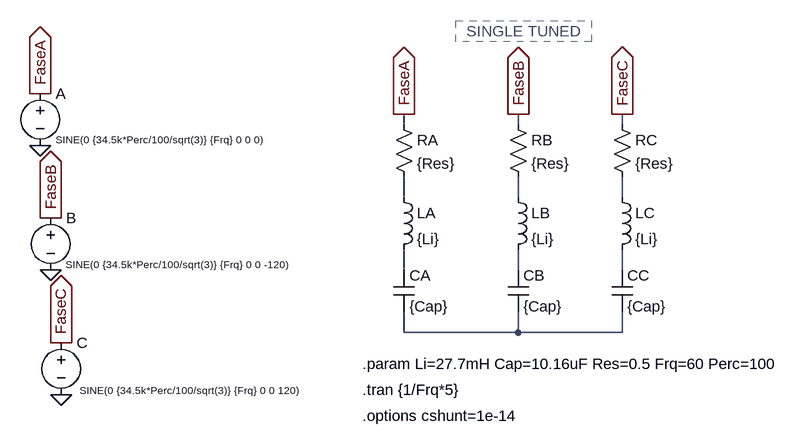
[diagram p0: schematic HarmonicFilterSigleTuned3Phase.asc]
HarmonicFilterSigleTuned3Phase.asc, the LTspice schematic file:
Version 4
SHEET 1 1632 680
WIRE 288 -16 288 -32
WIRE 464 -16 464 -32
WIRE 624 -16 624 -32
WIRE 288 96 288 64
WIRE 464 96 464 64
WIRE 624 96 624 64
WIRE 288 208 288 176
WIRE 464 208 464 176
WIRE 624 208 624 176
WIRE 288 304 288 272
WIRE 464 304 464 272
WIRE 464 304 288 304
WIRE 624 304 624 272
WIRE 624 304 464 304
FLAG -272 16 0
FLAG -256 208 0
FLAG -240 400 0
FLAG -272 -64 FaseA
IOPIN -272 -64 Out
FLAG 288 -32 FaseA
IOPIN 288 -32 Out
FLAG 464 -32 FaseB
IOPIN 464 -32 Out
FLAG 624 -32 FaseC
IOPIN 624 -32 Out
FLAG -256 128 FaseB
IOPIN -256 128 Out
FLAG -240 320 FaseC
IOPIN -240 320 Out
SYMBOL voltage -272 -80 R0
WINDOW 3 24 87 Left 1
WINDOW 123 31 86 Left 2
WINDOW 39 0 0 Left 0
SYMATTR Value SINE(0 {34.5k*Perc/100/sqrt(3)} {Frq} 0 0 0)
SYMATTR InstName A
SYMBOL res 272 -32 R0
SYMATTR InstName RA
SYMATTR Value {Res}
SYMBOL ind 272 80 R0
SYMATTR InstName LA
SYMATTR Value {Li}
SYMBOL cap 272 208 R0
SYMATTR InstName CA
SYMATTR Value {Cap}
SYMBOL res 448 -32 R0
SYMATTR InstName RB
SYMATTR Value {Res}
SYMBOL ind 448 80 R0
SYMATTR InstName LB
SYMATTR Value {Li}
SYMBOL cap 448 208 R0
SYMATTR InstName CB
SYMATTR Value {Cap}
SYMBOL res 608 -32 R0
SYMATTR InstName RC
SYMATTR Value {Res}
SYMBOL ind 608 80 R0
SYMATTR InstName LC
SYMATTR Value {Li}
SYMBOL cap 608 208 R0
SYMATTR InstName CC
SYMATTR Value {Cap}
SYMBOL voltage -256 112 R0
WINDOW 123 30 85 Left 2
WINDOW 39 0 0 Left 0
WINDOW 3 23 87 Left 1
SYMATTR Value SINE(0 {34.5k*Perc/100/sqrt(3)} {Frq} 0 0 -120)
SYMATTR InstName B
SYMBOL voltage -240 304 R0
WINDOW 123 31 85 Left 2
WINDOW 39 0 0 Left 0
WINDOW 3 29 89 Left 1
SYMATTR Value SINE(0 {34.5k*Perc/100/sqrt(3)} {Frq} 0 0 120)
SYMATTR InstName C
TEXT 224 352 Left 2 !.param Li=27.7mH Cap=10.16uF Res=0.5 Frq=60 Perc=100
TEXT 224 392 Left 2 !.tran {1/Frq*5}
TEXT 384 -160 Left 2 ;SINGLE TUNED
TEXT 224 432 Left 2 !.options cshunt=1e-14
RECTANGLE Normal 576 -144 368 -176 2

The netlist it stands for:
* HarmonicFilterSigleTuned3Phase.asc
V§A FaseA 0 SINE(0 {34.5k*Perc/100/sqrt(3)} {Frq} 0 0 0)
RA FaseA N001 {Res}
LA N001 N004 {Li}
CA N004 N007 {Cap}
RB FaseB N002 {Res}
LB N002 N005 {Li}
CB N005 N007 {Cap}
RC FaseC N003 {Res}
LC N003 N006 {Li}
CC N006 N007 {Cap}
V§B FaseB 0 SINE(0 {34.5k*Perc/100/sqrt(3)} {Frq} 0 0 -120)
V§C FaseC 0 SINE(0 {34.5k*Perc/100/sqrt(3)} {Frq} 0 0 120)
.param Li=27.7mH Cap=10.16uF Res=0.5 Frq=60 Perc=100
.tran {1/Frq*5}
* SINGLE TUNED
.options cshunt=1e-14
.backanno
.end